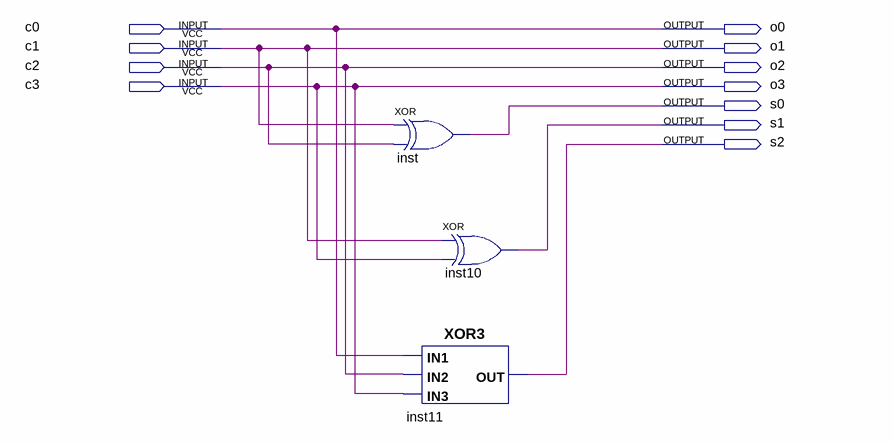
[diagram p0: schematic sheet]
// Quartus schematic decoder.bdf as structural Verilog: 3 symbols, 11 pins
module decoder (
  input  c0,
  input  c1,
  input  c2,
  input  c3,
  output o0,
  output o1,
  output o2,
  output o3,
  output s0,
  output s1,
  output s2
);

  xor inst (s0, c1, c2);
  xor inst10 (s1, c1, c3);
  XOR3 inst11 (.IN3(c3), .IN1(c0), .IN2(c2), .OUT(s2));

  assign o0 = c0;
  assign o1 = c1;
  assign o2 = c2;
  assign o3 = c3;
endmodule
